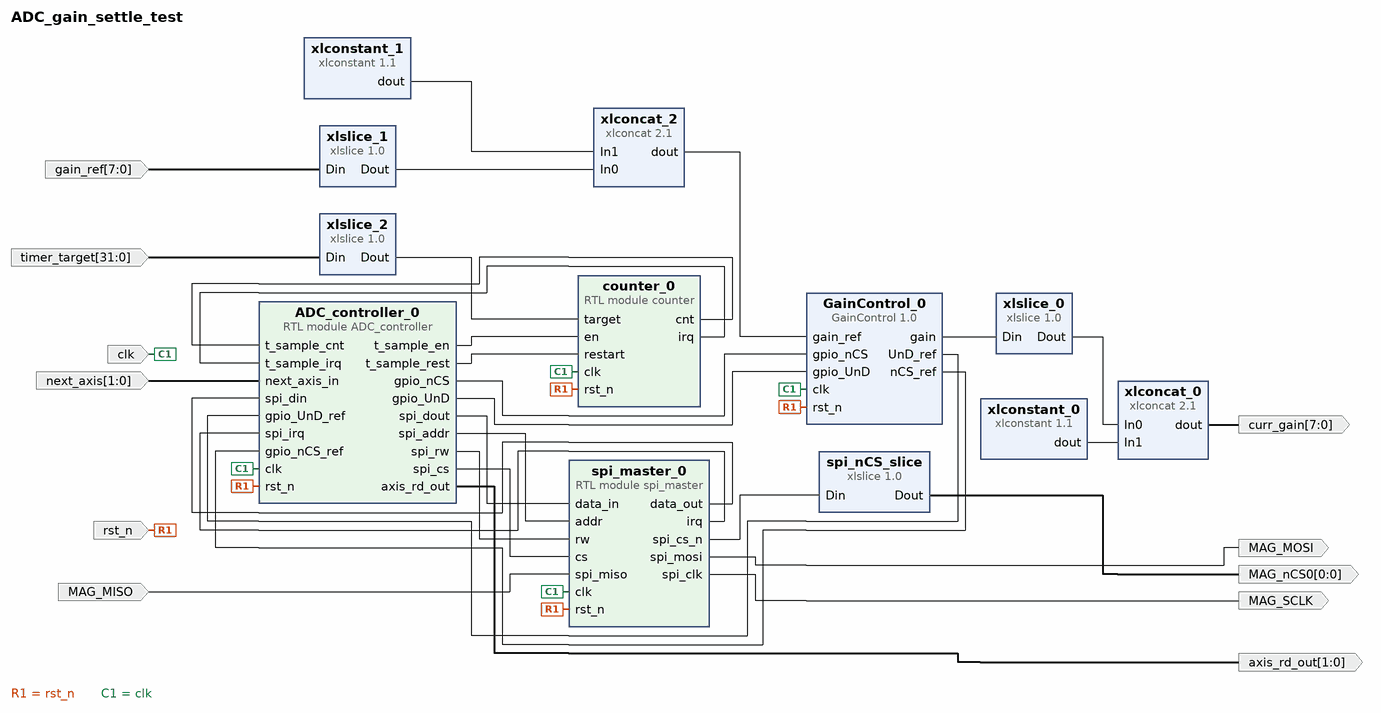
[diagram p0: block diagram of the top level]
# Vivado block design ADC_gain_settle_test, xczu3eg-sbva484-1-i, Vivado 2020.2
create_bd_design ADC_gain_settle_test

create_bd_port -dir O MAG_MOSI
create_bd_port -dir O -type clk MAG_SCLK
create_bd_port -dir I MAG_MISO
create_bd_port -dir O -from 1 -to 0 axis_rd_out
create_bd_port -dir O -from 0 -to 0 MAG_nCS0
create_bd_port -dir I -from 31 -to 0 timer_target
create_bd_port -dir O -from 7 -to 0 curr_gain
create_bd_port -dir I -from 7 -to 0 gain_ref
create_bd_port -dir I clk
create_bd_port -dir I rst_n
create_bd_port -dir I -from 1 -to 0 next_axis

create_bd_cell -type module -reference spi_master spi_master_0
create_bd_cell -type ip -vlnv xilinx.com:ip:xlslice:1.0 spi_nCS_slice
set_property -dict {CONFIG.DIN_FROM 0 CONFIG.DIN_WIDTH 8 CONFIG.DOUT_WIDTH 1} [get_bd_cells spi_nCS_slice]
create_bd_cell -type ip -vlnv xilinx.com:ip:xlslice:1.0 xlslice_0
set_property -dict {CONFIG.DIN_FROM 5 CONFIG.DIN_WIDTH 24 CONFIG.DOUT_WIDTH 6} [get_bd_cells xlslice_0]
create_bd_cell -type ip -vlnv xilinx.com:ip:xlconcat:2.1 xlconcat_0
create_bd_cell -type ip -vlnv xilinx.com:ip:xlconstant:1.1 xlconstant_0
set_property -dict {CONFIG.CONST_VAL 0 CONFIG.CONST_WIDTH 2} [get_bd_cells xlconstant_0]
create_bd_cell -type ip -vlnv xilinx.com:ip:xlslice:1.0 xlslice_1
set_property -dict {CONFIG.DIN_FROM 5 CONFIG.DIN_WIDTH 8 CONFIG.DOUT_WIDTH 6} [get_bd_cells xlslice_1]
create_bd_cell -type ip -vlnv xilinx.com:ip:xlslice:1.0 xlslice_2
set_property -dict {CONFIG.DIN_FROM 19 CONFIG.DIN_WIDTH 32 CONFIG.DOUT_WIDTH 20} [get_bd_cells xlslice_2]
create_bd_cell -type ip -vlnv xilinx.com:ip:xlconcat:2.1 xlconcat_2
create_bd_cell -type ip -vlnv xilinx.com:ip:xlconstant:1.1 xlconstant_1
set_property -dict {CONFIG.CONST_VAL 0 CONFIG.CONST_WIDTH 18} [get_bd_cells xlconstant_1]
create_bd_cell -type module -reference counter counter_0
set_property -dict {CONFIG.n_bits 20} [get_bd_cells counter_0]
create_bd_cell -type ip -vlnv DIII:PL-Mag-Sensor:GainControl:1.0 GainControl_0
create_bd_cell -type module -reference ADC_controller ADC_controller_0

# ---- connections ----

connect_bd_net -net rst_n_0_1 [get_bd_ports rst_n] \
  [get_bd_pins spi_master_0/rst_n] [get_bd_pins counter_0/rst_n] [get_bd_pins GainControl_0/rst_n] \
  [get_bd_pins ADC_controller_0/rst_n]
connect_bd_net [get_bd_pins spi_master_0/data_out] [get_bd_pins ADC_controller_0/spi_din]
connect_bd_net [get_bd_pins spi_master_0/irq] [get_bd_pins ADC_controller_0/spi_irq]
connect_bd_net [get_bd_pins spi_master_0/spi_mosi] [get_bd_ports MAG_MOSI]
connect_bd_net [get_bd_pins spi_master_0/spi_clk] [get_bd_ports MAG_SCLK]
connect_bd_net [get_bd_pins spi_master_0/spi_cs_n] [get_bd_pins spi_nCS_slice/Din]
connect_bd_net -net spi_miso_0_1 [get_bd_ports MAG_MISO] [get_bd_pins spi_master_0/spi_miso]
connect_bd_net [get_bd_pins ADC_controller_0/spi_dout] [get_bd_pins spi_master_0/data_in]
connect_bd_net [get_bd_pins ADC_controller_0/spi_addr] [get_bd_pins spi_master_0/addr]
connect_bd_net [get_bd_pins ADC_controller_0/spi_rw] [get_bd_pins spi_master_0/rw]
connect_bd_net [get_bd_pins ADC_controller_0/spi_cs] [get_bd_pins spi_master_0/cs]
connect_bd_net [get_bd_pins ADC_controller_0/t_sample_en] [get_bd_pins counter_0/en]
connect_bd_net [get_bd_pins ADC_controller_0/t_sample_rest] [get_bd_pins counter_0/restart]
connect_bd_net [get_bd_pins counter_0/cnt] [get_bd_pins ADC_controller_0/t_sample_cnt]
connect_bd_net [get_bd_pins counter_0/irq] [get_bd_pins ADC_controller_0/t_sample_irq]
connect_bd_net [get_bd_pins ADC_controller_0/axis_rd_out] [get_bd_ports axis_rd_out]
connect_bd_net [get_bd_pins xlslice_0/Dout] [get_bd_pins xlconcat_0/In0]
connect_bd_net [get_bd_pins xlconstant_0/dout] [get_bd_pins xlconcat_0/In1]
connect_bd_net [get_bd_pins xlslice_2/Dout] [get_bd_pins counter_0/target]
connect_bd_net -net zynq_ultra_ps_e_0_pl_clk0 [get_bd_ports clk] \
  [get_bd_pins spi_master_0/clk] [get_bd_pins counter_0/clk] [get_bd_pins GainControl_0/clk] \
  [get_bd_pins ADC_controller_0/clk]
connect_bd_net [get_bd_pins spi_nCS_slice/Dout] [get_bd_ports MAG_nCS0]
connect_bd_net [get_bd_pins xlslice_1/Dout] [get_bd_pins xlconcat_2/In0]
connect_bd_net [get_bd_pins xlconstant_1/dout] [get_bd_pins xlconcat_2/In1]
connect_bd_net -net Din_0_1 [get_bd_ports timer_target] [get_bd_pins xlslice_2/Din]
connect_bd_net [get_bd_pins xlconcat_0/dout] [get_bd_ports curr_gain]
connect_bd_net -net Din_0_2 [get_bd_ports gain_ref] [get_bd_pins xlslice_1/Din]
connect_bd_net [get_bd_pins ADC_controller_0/gpio_nCS] [get_bd_pins GainControl_0/gpio_nCS]
connect_bd_net [get_bd_pins xlconcat_2/dout] [get_bd_pins GainControl_0/gain_ref]
connect_bd_net [get_bd_pins ADC_controller_0/gpio_UnD] [get_bd_pins GainControl_0/gpio_UnD]
connect_bd_net [get_bd_pins GainControl_0/UnD_ref] [get_bd_pins ADC_controller_0/gpio_UnD_ref]
connect_bd_net [get_bd_pins GainControl_0/gain] [get_bd_pins xlslice_0/Din]
connect_bd_net [get_bd_pins GainControl_0/nCS_ref] [get_bd_pins ADC_controller_0/gpio_nCS_ref]
connect_bd_net -net next_axis_in_0_1 [get_bd_ports next_axis] [get_bd_pins ADC_controller_0/next_axis_in]

validate_bd_design
save_bd_design
